# Altium project BNV-BatteryPack_BottomPCB.PrjPcb
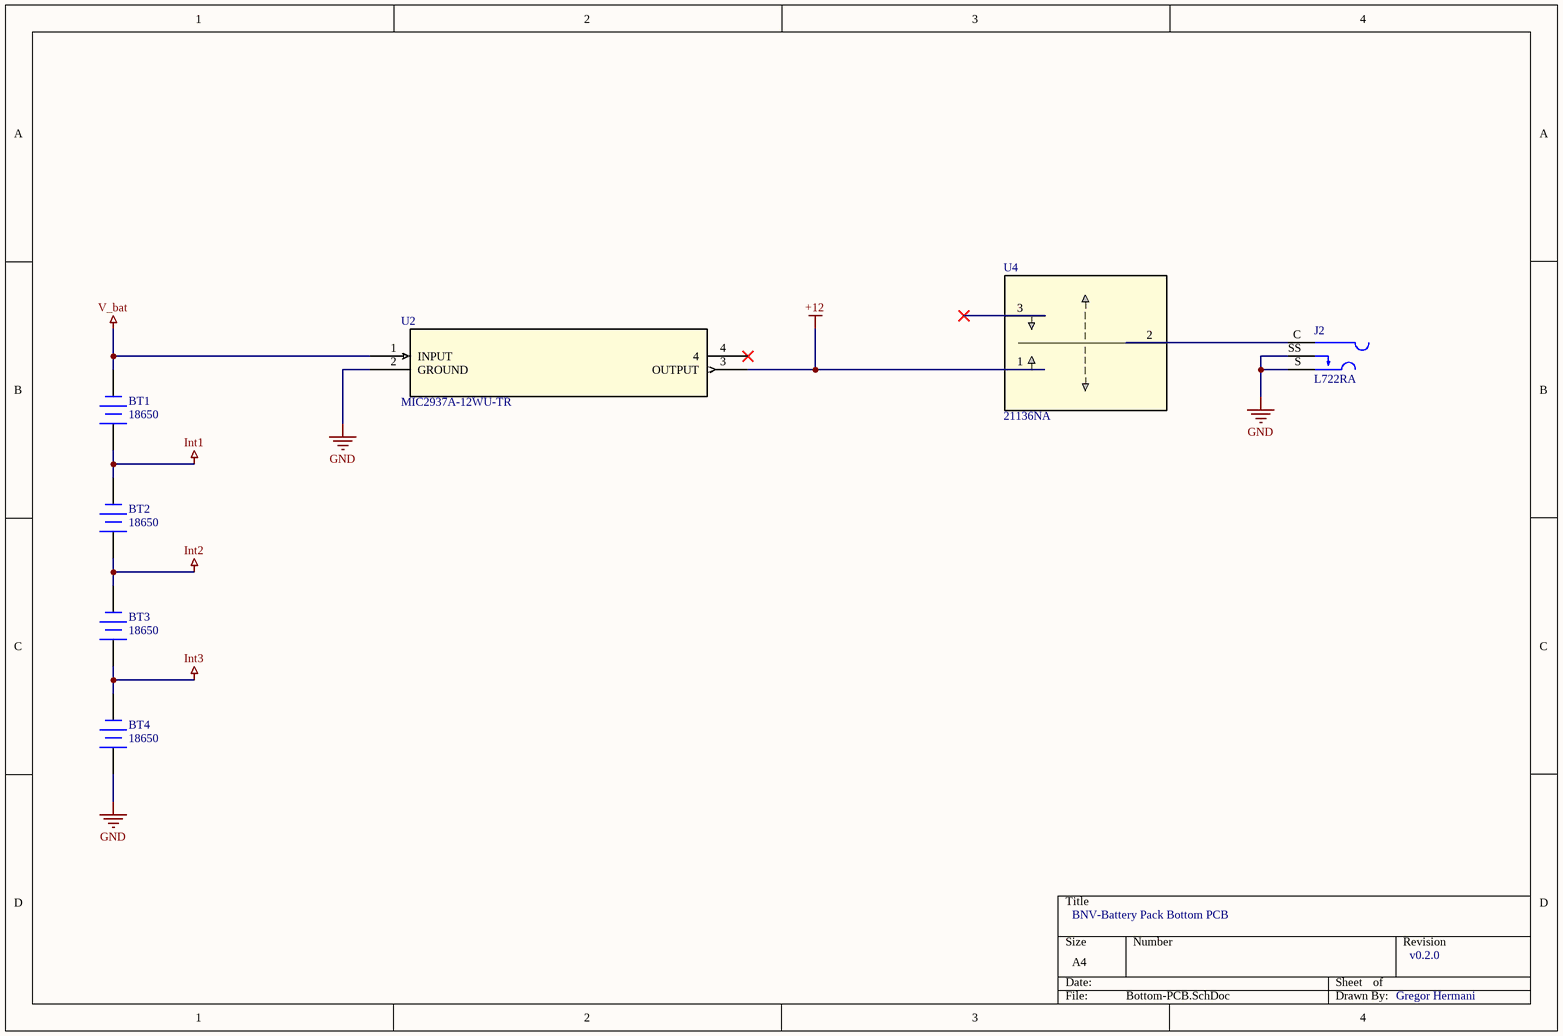
[diagram p0: Bottom-PCB.SchDoc]
1 sheet, 7 parts. Net scope: global (net labels, ports and power ports of the same name join across sheets).
Board file: Bottom-PCB.PcbDoc

## Sheet Bottom-PCB.SchDoc
size A4; SheetNumber: 1; SheetTotal: 1

### Parts
BT1  18650  [BAT-2]
BT2  18650  [BAT-2]
BT3  18650  [BAT-2]
BT4  18650  [BAT-2]
J2  L722RA  [SWITCHCRAFT_L722RA]
U2  MIC2937A-12WU-TR  [TO-263-3_MCH]
U4  21136NA  [SWITCH_21136_APM]

### Nets
+12: U2.3(OUTPUT) U4.1
GND: BT4.1(+) J2.S(SLEEVE) J2.SS(SLEEVE_SHUNT) U2.2(GROUND)
Int1: BT1.1(+) BT2.2(-)
Int2: BT2.1(+) BT3.2(-)
Int3: BT3.1(+) BT4.2(-)
V_bat: BT1.2(-) U2.1(INPUT)
NetJ2_C: J2.C(CENTRE_PIN) U4.2

Not connected (* = marked no-connect by the designer): U2 4*; U4 3*

### Notes on the sheet
- BNV-Battery Pack Bottom PCB
- v0.2.0
- Gregor Hermani

### Library data of the parts
BT1-BT4 = Battery: Multicell Battery; Published: 24-Mar-1999; LatestRevisionDate: 17-Jul-2002; LatestRevisionNote: Re-released for DXP Platform.; PackageReference: BAT-2; Publisher: Altium Limited; PackageDescription: Battery; 2 Leads
J2 = L722RA: Power Barrel Connector Jack 2.50mm ID (0.098"), 5.50mm OD (0.217") Panel Mount, Through Hole, Right Angle; Package: None; Price: None; Value: *; MP: L722RA; Availability: Unavailable
U2 = MIC2937A-12WU-TR: No Description Available; Mfr_Name: Microchip; Copyright: Copyright (C) 2021 Ultra Librarian. All rights reserved.; Manufacturer_Part_Number: MIC2937A-12WU-TR; RefDes: RefDes; Type: DEV
U4 = 21136NA: No Description Available; Mfr_Name: Apem; Copyright: Copyright (C) 2021 Ultra Librarian. All rights reserved.; Manufacturer_Part_Number: 21136NA; RefDes: RefDes; Type: DEV